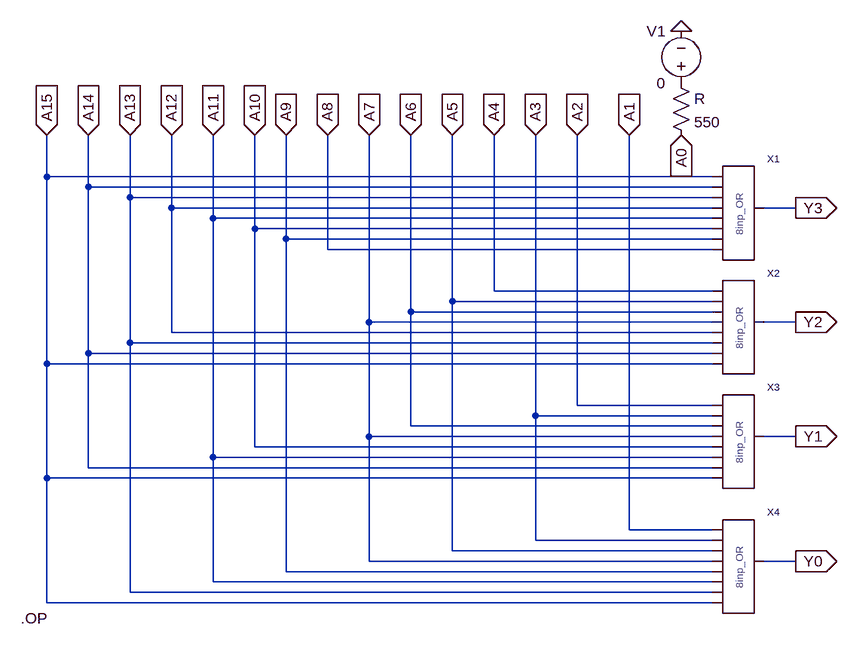
[diagram p0: schematic Encod16-4.asc]
Encod16-4.asc, the LTspice schematic file:
Version 4
SHEET 1 880 680
WIRE -496 -64 -496 -128
WIRE 528 -64 -496 -64
WIRE -432 -48 -432 -128
WIRE 528 -48 -432 -48
WIRE -368 -32 -368 -128
WIRE 528 -32 -368 -32
WIRE -304 -16 -304 -128
WIRE 528 -16 -304 -16
WIRE 656 -16 608 -16
WIRE -240 0 -240 -128
WIRE 528 0 -240 0
WIRE -176 16 -176 -128
WIRE 528 16 -176 16
WIRE -128 32 -128 -128
WIRE 528 32 -128 32
WIRE -64 48 -64 -128
WIRE 528 48 -64 48
WIRE 192 112 192 -128
WIRE 528 112 192 112
WIRE 128 128 128 -128
WIRE 528 128 128 128
WIRE 64 144 64 -128
WIRE 528 144 64 144
WIRE 0 160 0 -128
WIRE 528 160 0 160
WIRE 656 160 608 160
WIRE -304 176 -304 -16
WIRE 528 176 -304 176
WIRE -368 192 -368 -32
WIRE 528 192 -368 192
WIRE -432 208 -432 -48
WIRE 528 208 -432 208
WIRE -496 224 -496 -64
WIRE 528 224 -496 224
WIRE 320 288 320 -128
WIRE 528 288 320 288
WIRE 256 304 256 -128
WIRE 528 304 256 304
WIRE 64 320 64 144
WIRE 528 320 64 320
WIRE 0 336 0 160
WIRE 528 336 0 336
WIRE 656 336 608 336
WIRE -176 352 -176 16
WIRE 528 352 -176 352
WIRE -240 368 -240 0
WIRE 528 368 -240 368
WIRE -432 384 -432 208
WIRE 528 384 -432 384
WIRE -496 400 -496 224
WIRE 528 400 -496 400
WIRE 400 480 400 -128
WIRE 528 480 400 480
WIRE 256 496 256 304
WIRE 528 496 256 496
WIRE 128 512 128 128
WIRE 528 512 128 512
WIRE 0 528 0 336
WIRE 528 528 0 528
WIRE 656 528 608 528
WIRE -128 544 -128 32
WIRE 528 544 -128 544
WIRE -240 560 -240 368
WIRE 528 560 -240 560
WIRE -368 576 -368 192
WIRE 528 576 -368 576
WIRE -496 592 -496 400
WIRE 528 592 -496 592
FLAG 656 -16 Y3
IOPIN 656 -16 Out
FLAG 656 160 Y2
IOPIN 656 160 Out
FLAG 656 336 Y1
IOPIN 656 336 Out
FLAG 656 528 Y0
IOPIN 656 528 Out
FLAG -496 -128 A15
IOPIN -496 -128 In
FLAG -432 -128 A14
IOPIN -432 -128 In
FLAG -368 -128 A13
IOPIN -368 -128 In
FLAG -304 -128 A12
IOPIN -304 -128 In
FLAG -240 -128 A11
IOPIN -240 -128 In
FLAG -176 -128 A10
IOPIN -176 -128 In
FLAG -128 -128 A9
IOPIN -128 -128 In
FLAG -64 -128 A8
IOPIN -64 -128 In
FLAG 0 -128 A7
IOPIN 0 -128 In
FLAG 64 -128 A6
IOPIN 64 -128 In
FLAG 128 -128 A5
IOPIN 128 -128 In
FLAG 192 -128 A4
IOPIN 192 -128 In
FLAG 256 -128 A3
IOPIN 256 -128 In
FLAG 320 -128 A2
IOPIN 320 -128 In
FLAG 400 -128 A1
IOPIN 400 -128 In
FLAG 480 -128 A0
IOPIN 480 -128 In
FLAG 480 -288 0
SYMBOL OR 496 -16 R0
SYMATTR InstName X1
SYMBOL OR 496 160 R0
SYMATTR InstName X2
SYMBOL OR 496 336 R0
SYMATTR InstName X3
SYMBOL OR 496 528 R0
SYMATTR InstName X4
SYMBOL res 464 -224 R0
SYMATTR InstName R
SYMATTR Value 550
SYMBOL voltage 480 -192 R180
WINDOW 0 24 96 Left 2
WINDOW 3 24 16 Left 2
SYMATTR InstName V1
SYMATTR Value 0
TEXT -536 616 Left 2 !.OP

The netlist it stands for:
* Encod16-4.asc
XX1 A15 A14 A13 A12 A11 A10 A9 A8 Y3 OR  ; pins A7 A6 A5 A4 A3 A2 A1 A0 Y
XX2 A4 A5 A6 A7 A12 A13 A14 A15 Y2 OR  ; pins A7 A6 A5 A4 A3 A2 A1 A0 Y
XX3 A2 A3 A6 A7 A10 A11 A14 A15 Y1 OR  ; pins A7 A6 A5 A4 A3 A2 A1 A0 Y
XX4 A1 A3 A5 A7 A9 A11 A13 A15 Y0 OR  ; pins A7 A6 A5 A4 A3 A2 A1 A0 Y
R P001 A0 550
V1 P001 0 0
.OP
.backanno
.end